# EasyEDA schematic schematic.json
TITLE: PiKey; REV: 2.0; Date: 2025-08-21; Sheet: 1/1; Drawn By: acidicts; Company: UNKNOWN
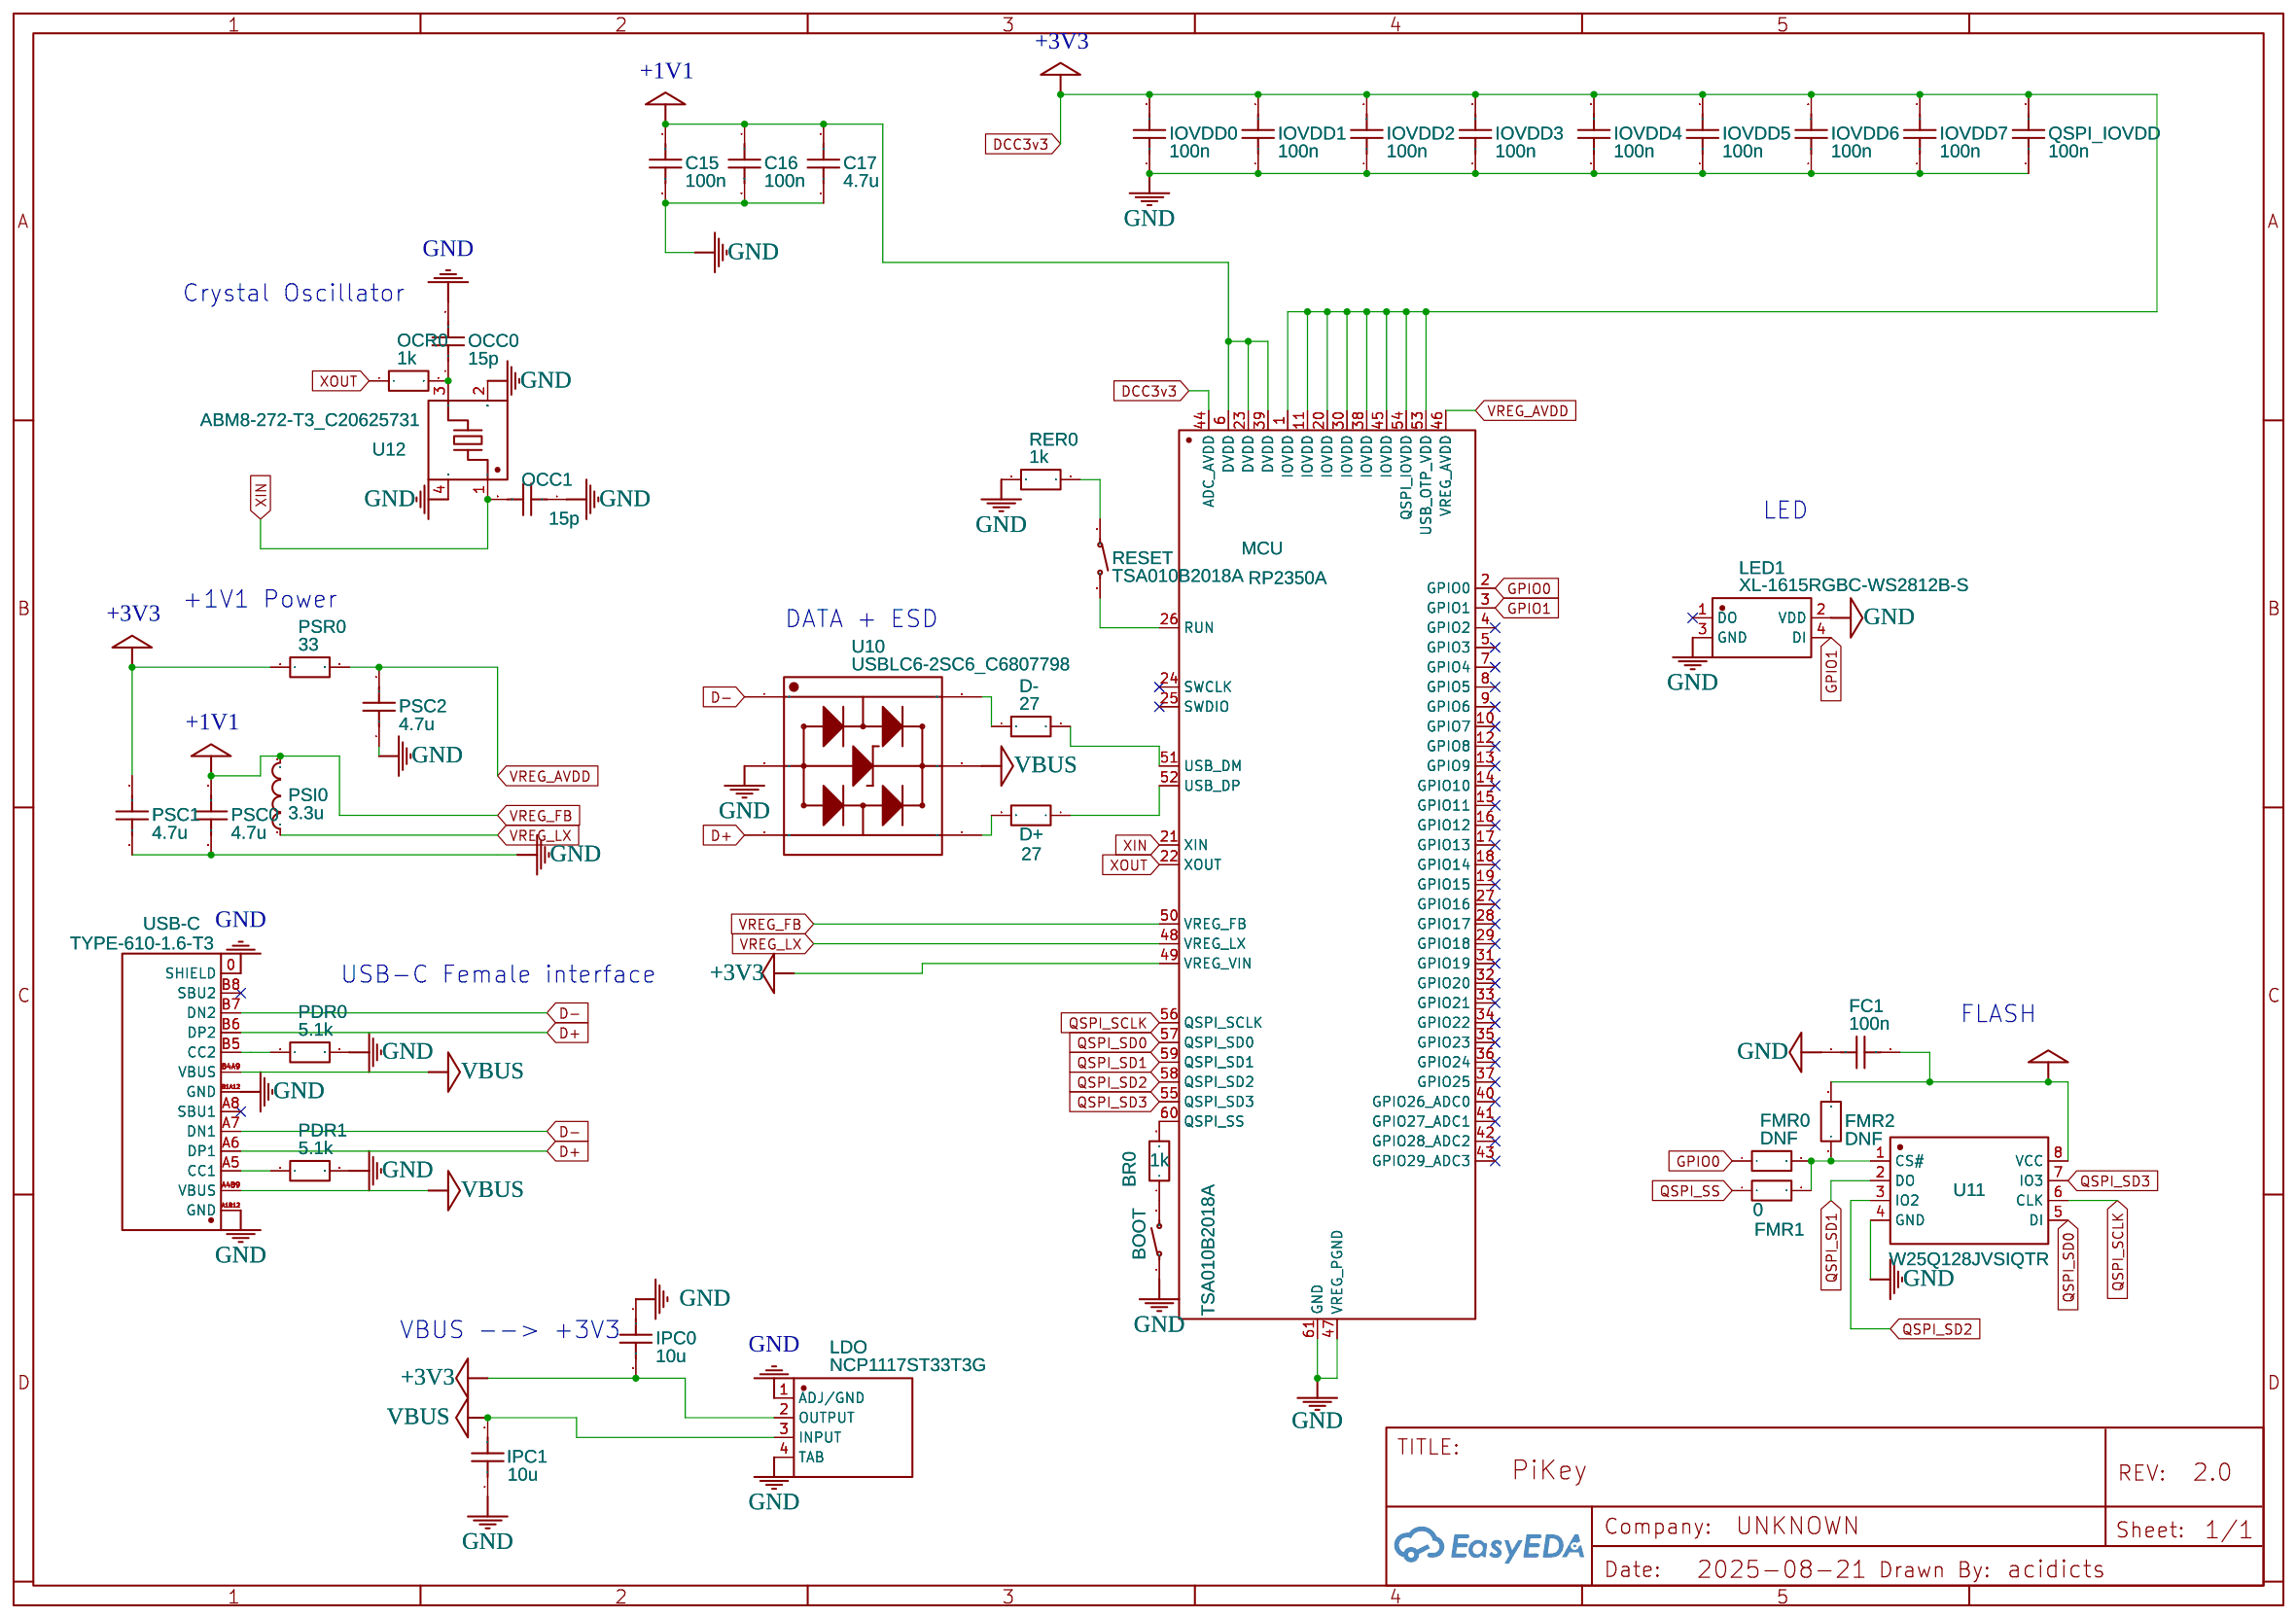
[diagram p0: schematic sheet]

## Parts
BOOT  TSA010B2018A  [SW-SMD_L3.9-W3.0-P4.45]
BR0  1k  [R0603]
C15  100n  [C0603]
C16  100n  [C0603]
C17  4.7u  [C0603]
D+  27  [R0603]
D-  27  [R0603]
FC1  100n  [C0603]
FMR0  DNF  [R0603]
FMR1  0  [R0603]
FMR2  DNF  [R0603]
IOVDD0  100n  [C0603]
IOVDD1  100n  [C0603]
IOVDD2  100n  [C0603]
IOVDD3  100n  [C0603]
IOVDD4  100n  [C0603]
IOVDD5  100n  [C0603]
IOVDD6  100n  [C0603]
IOVDD7  100n  [C0603]
IPC0  10u  [C0603]
IPC1  10u  [C0603]
LDO  NCP1117ST33T3G  [SOT-223-3_L6.5-W3.4-P2.30-LS7.0-BR]
LED1  XL-1615RGBC-WS2812B-S  [LED-SMD_4P-L1.6-W1.5_XL-1615RGBC-WS2812B-S]
MCU  RP2350A  [QFN-60_L7.0-W7.0-P0.40-TL-EP3.4]
OCC0  15p  [C0603]
OCC1  15p  [C0603]
OCR0  1k  [R0603]
PDR0  5.1k  [R0603]
PDR1  5.1k  [R0603]
PSC0  4.7u  [C0603]
PSC1  4.7u  [C0603]
PSC2  4.7u  [C0603]
PSI0  3.3u  [L0603]
PSR0  33  [R0603]
QSPI_IOVDD  100n  [C0603]
RER0  1k  [R0603]
RESET  TSA010B2018A  [SW-SMD_L3.9-W3.0-P4.45]
U10  USBLC6-2SC6_C6807798  [SOT-23-6_L2.9-W1.6-P0.95-LS2.8-BL]
U11  W25Q128JVSIQTR  [SOIC-8_L5.3-W5.3-P1.27-LS8.0-BL]
U12  ABM8-272-T3_C20625731  [CRYSTAL-SMD_4P-L3.2-W2.5-BL]
USB-C  TYPE-610-1.6-T3  [USB-C-SMD_TYPE-C-16P-610-1.6-T3]

## Library data of the parts
BOOT RESET = TSA010B2018A: Contributor: LCSC; Supplier: LCSC; Supplier Part: C2888920; Manufacturer: BZCN(博众电气); JLCPCB Part Class: Extended Part
BR0 D+ D- FMR0-FMR2 OCR0 PDR0 PDR1 PSR0 RER0 = R_0603_EU: Contributor: LCEDA_Lib
C15-C17 FC1 IOVDD0-IOVDD7 IPC0 IPC1 OCC0 OCC1 PSC0-PSC2 QSPI_IOVDD = C_0603_US: Contributor: LCEDA_Lib
LDO = NCP1117ST33T3G: Supplier: LCSC; Manufacturer: onsemi(安森美); Supplier Part: C26537; JLCPCB Part Class: Extended Part
LED1 = XL-1615RGBC-WS2812B-S: Supplier: LCSC; Supplier Part: C41413180; Manufacturer: XINGLIGHT(成兴光); Contributor: lcsc; JLCPCB Part Class: Extended Part
MCU = RP2350A: Supplier: LCSC; Supplier Part: C9900136995; Manufacturer: null; JLCPCB Part Class: Extended Part; Contributor: lcsc
PSI0 = L0603_US: Contributor: LCEDA_Lib
U10 = USBLC6-2SC6_C6807798: Supplier: LCSC; Supplier Part: C6807798; Manufacturer: FUXINSEMI(富芯森美); Manufacturer Part: USBLC6-2SC6; Contributor: lcsc; JLCPCB Part Class: Extended Part
U11 = W25Q128JVSIQTR: Supplier: LCSC; Manufacturer: Winbond(华邦); Manufacturer Part: W25Q128JVSIQ; Supplier Part: C97521; JLCPCB Part Class: Basic Part
U12 = ABM8-272-T3_C20625731: Supplier: LCSC; Supplier Part: C20625731; Manufacturer: ABRACON; Manufacturer Part: ABM8-272-T3; JLCPCB Part Class: Extended Part; Contributor: lcsc
USB-C = TYPE-610-1.6-T3: Contributor: lcsc; Supplier: LCSC; Supplier Part: C2972115; Manufacturer: Yuandi(元迪); JLCPCB Part Class: Extended Part

## Nets
+1V1: C15.1 C16.1 C17.1 MCU.6(DVDD) MCU.23(DVDD) MCU.39(DVDD) MCU.50(VREG_FB) PSC0.2 PSI0.2
+3V3: FC1.2 FMR2.2 IOVDD0.2 IOVDD1.2 IOVDD2.2 IOVDD3.2 IOVDD4.2 IOVDD5.2 IOVDD6.2 IOVDD7.2 IPC0.2 LDO.2(OUTPUT) MCU.1(IOVDD) MCU.11(IOVDD) MCU.20(IOVDD) MCU.30(IOVDD) MCU.38(IOVDD) MCU.44(ADC_AVDD) MCU.45(IOVDD) MCU.49(VREG_VIN) MCU.53(USB_OTP_VDD) MCU.54(QSPI_IOVDD) PSC1.2 PSR0.1 QSPI_IOVDD.2 U11.8(VCC)
GND: BOOT.1 C15.2 C16.2 C17.2 FC1.1 IOVDD0.1 IOVDD1.1 IOVDD2.1 IOVDD3.1 IOVDD4.1 IOVDD5.1 IOVDD6.1 IOVDD7.1 IPC0.1 IPC1.1 LDO.1(ADJ/GND) LDO.4(TAB) LED1.2(VDD) LED1.3(GND) MCU.47(VREG_PGND) MCU.61(GND) OCC0.2 OCC1.1 PDR0.2 PDR1.2 PSC0.1 PSC1.1 PSC2.1 QSPI_IOVDD.1 RER0.1 U10.2(GND) U11.4(GND) U12.2(GND) U12.4(GND) USB-C.0(SHIELD) USB-C.A1B12(GND) USB-C.B1A12(GND)
VBUS: IPC1.2 LDO.3(INPUT) U10.5(VCC) USB-C.A4B9(VBUS) USB-C.B4A9(VBUS)
D+: U10.3(I/O2) USB-C.A6(DP1) USB-C.B6(DP2)
D-: U10.1(I/O1) USB-C.A7(DN1) USB-C.B7(DN2)
GPIO0: FMR0.1 MCU.2(GPIO0)
GPIO1: LED1.4(DI) MCU.3(GPIO1)
QSPI_SCLK: MCU.56(QSPI_SCLK) U11.6(CLK)
QSPI_SD0: MCU.57(QSPI_SD0) U11.5(DI)
QSPI_SD1: MCU.59(QSPI_SD1) U11.2(DO)
QSPI_SD2: MCU.58(QSPI_SD2) U11.3(IO2)
QSPI_SD3: MCU.55(QSPI_SD3) U11.7(IO3)
QSPI_SS: FMR1.1
VREG_AVDD: MCU.46(VREG_AVDD) PSC2.2 PSR0.2
VREG_LX: MCU.48(VREG_LX) PSI0.1
XIN: MCU.21(XIN) OCC1.2 U12.1
XOUT: MCU.22(XOUT) OCR0.1
Net-(BOOT-2): BOOT.2 BR0.1
Net-(BR0-2): BR0.2 MCU.60(QSPI_SS)
Net-(D+-1): D+.1 MCU.52(USB_DP)
Net-(D+-2): D+.2 U10.4(I/O2)
Net-(D--1): D-.1 U10.6(I/O1)
Net-(D--2): D-.2 MCU.51(USB_DM)
Net-(FMR0-2): FMR0.2 FMR1.2 FMR2.1 U11.1(CS#)
Net-(MCU-26): MCU.26(RUN) RESET.2
Net-(OCC0-1): OCC0.1 OCR0.2 U12.3
Net-(PDR0-1): PDR0.1 USB-C.B5(CC2)
Net-(PDR1-1): PDR1.1 USB-C.A5(CC1)
Net-(RER0-2): RER0.2 RESET.1

Not connected (* = marked no-connect by the designer): LED1 1(DO)*; MCU 4(GPIO2)* 5(GPIO3)* 7(GPIO4)* 8(GPIO5)* 9(GPIO6)* 10(GPIO7)* 12(GPIO8)* 13(GPIO9)* 14(GPIO10)* 15(GPIO11)* 16(GPIO12)* 17(GPIO13)* 18(GPIO14)* 19(GPIO15)* 24(SWCLK)* 25(SWDIO)* 27(GPIO16)* 28(GPIO17)* 29(GPIO18)* 31(GPIO19)* 32(GPIO20)* 33(GPIO21)* 34(GPIO22)* 35(GPIO23)* 36(GPIO24)* 37(GPIO25)* 40(GPIO26_ADC0)* 41(GPIO27_ADC1)* 42(GPIO28_ADC2)* 43(GPIO29_ADC3)*; USB-C A8(SBU1)* B8(SBU2)*

## Notes on the sheet
- Crystal Oscillator
- LED
- +1V1 Power
- DATA + ESD
- USB-C Female interface
- FLASH
- VBUS --> +3V3
